# Altium schematic sheet limiter.SchDoc
size A; SheetNumber: 1; SheetTotal: 2
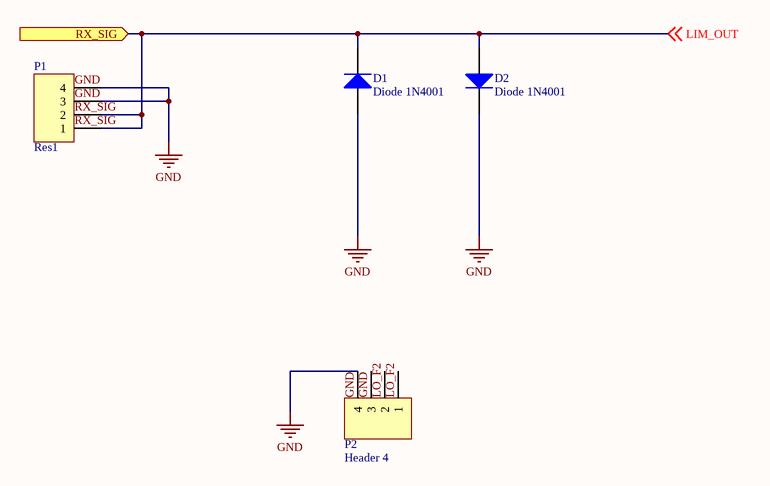
[diagram p0: limiter.SchDoc]

## Parts
D1  Diode 1N4001  [DO-41]
D2  Diode 1N4001  [DO-41]
P1  Res1  [HDR1X4]
P2  Header 4  [HDR1X4]

## Ports
RX_SIG (in)

## Nets
GND: D1.1(A) D2.2(K) P1.3 P1.4 P2.4
LIM_OUT: D1.2(K) D2.1(A) P1.1 P1.2 ; off-sheet LIM_OUT, port RX_SIG

Not connected (* = marked no-connect by the designer): P2 1 2 3

## Notes on the sheet
- Labels drawn without touching a wire or pin: GND, LO_F2, RX_SIG

## Library data of the parts
D1 D2 = Diode 1N4001: 1 Amp General Purpose Rectifier; Published: 8-Jun-2000; LatestRevisionDate: 17-Jul-2002; LatestRevisionNote: Re-released for DXP Platform.; DatasheetVersion: 1998; PackageVersion: Aug-1999; PackageReference: DO-41; Publisher: Altium Limited; PackageDescription: Diode, Axial; Body 5.2 x 2.7 mm (LxDia. max), Lead Dia. 0.86 mm (max); Code_JEDEC: DO-204-AL; ComponentLink1Description: Manufacturer Link; ComponentLink1URL: http://www.fairchildsemi.com/; ComponentLink2Description: Datasheet; ComponentLink2URL: http://www.fairchildsemi.com/ds/1N%2F1N4001.pdf
P1 P2 = Header 4: Header, 4-Pin; LatestRevisionDate: 17-Jul-2002; LatestRevisionNote: Re-released for DXP Platform.; Publisher: Altium Limited